# EAGLE design FXOS8700 without Extender (EAGLE 7.3.0)
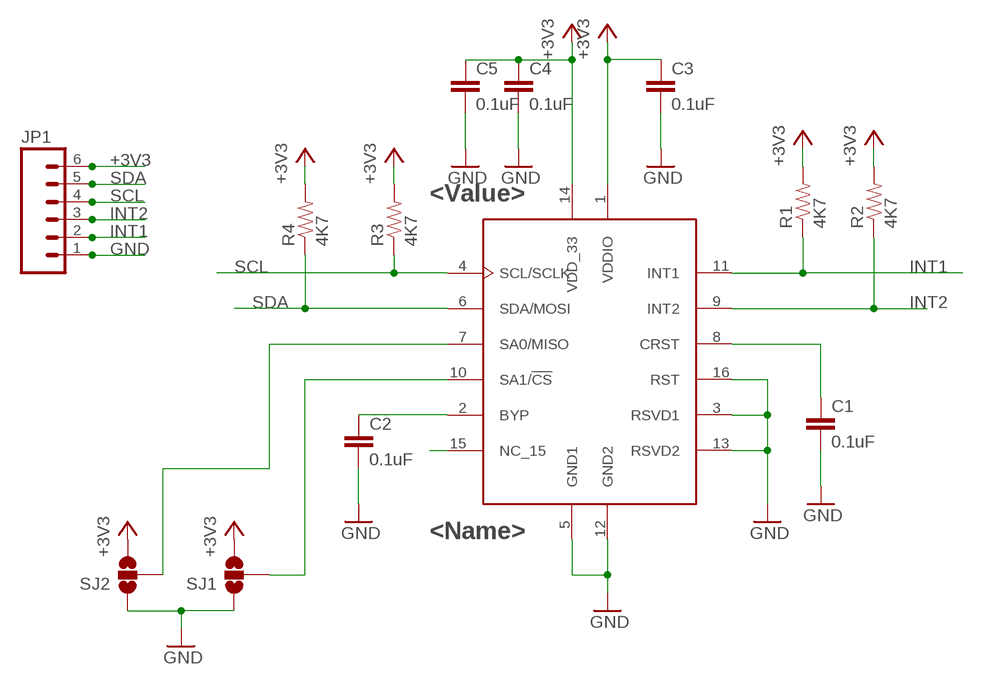
[diagram p0: schematic, sheet 1]

## Parts
C1  0.1uF  CAP0805  [0805]
C2  0.1uF  CAP0805  [0805]
C3  0.1uF  CAP0805  [0805]
C4  0.1uF  CAP0805  [0805]
C5  0.1uF  CAP0805  [0805]
JP1  M06LOCK  [1X06_LOCK]
R1  4K7  RESISTOR0805-RES  [0805]
R2  4K7  RESISTOR0805-RES  [0805]
R3  4K7  RESISTOR0805-RES  [0805]
R4  4K7  RESISTOR0805-RES  [0805]
SJ1  SOLDERJUMPER_2WAYPASTE1&2  [SJ_3_PASTE1&2]
SJ2  SOLDERJUMPER_2WAYPASTE1&2  [SJ_3_PASTE1&2]
U$1  FXOS870CQ  [QFN16_0P5_3X3]

## Nets
+3V3: C3.1 C4.1 C5.1 JP1.6 R1.2 R2.2 R3.2 R4.2 SJ1.3 SJ2.3 U$1.1(VDDIO) U$1.14(VDD_33)
GND: C1.2 C2.2 C3.2 C4.2 C5.2 JP1.1 SJ1.1 SJ2.1 U$1.3(RSVD1) U$1.5(GND1) U$1.12(GND2) U$1.13(RSVD2) U$1.16(RST)
INT1: JP1.2 R1.1 U$1.11(INT1)
INT2: JP1.3 R2.1 U$1.9(INT2)
N$5: C2.1 U$1.2(BYP)
N$6: U$1.15(NC_15)
RST: C1.1 U$1.8(CRST)
SA0: SJ2.2 U$1.7(SA0/MISO)
SA1: SJ1.2 U$1.10(SA1/!CS)
SCL: JP1.4 R3.1 U$1.4(SCL/SCLK)
SDA: JP1.5 R4.1 U$1.6(SDA/MOSI)

## Library data of the parts
C1-C5 = SparkFun-Capacitors:CAP: Capacitor Standard 0603 ceramic capacitor, and 0.1" leaded capacitor.
JP1 = SparkFun-Connectors:M06: Header 6 Standard 6-pin 0.1" header. Use with straight break away headers (SKU : PRT-00116), right angle break away headers (PRT-00553), swiss pins (PRT-00743), machine pins (PRT-00117), and female headers (PRT-00115). Molex polarized connector foot print use with SKU : PRT-08094 with associated crimp pins and housings. NOTES ON THE VARIANTS LOCK and LOCK_LONGPADS... This footprint was designed to help hold the alignment of a through-hole component (i.e. 6-pin header) while soldering it into place. You may notice that each hole has been shifted either up or down by 0.005 of an inch from it's more standard position (which is a perfectly straight line). This slight alteration caused the pins (the squares in the middle) to touch the edges of the holes. Because they are alternating, it causes a "brace" to hold the component in place. 0.005 has proven to be the perfect amount of "off-center" position when using our standard breakaway headers. Although looks a little odd when you look at the bare footprint, once you have a header in there, the alteration is very hard to notice. Also,if you push a header all the way into place, it is covered up entirely on the bottom side. This idea of altering the position of holes to aid alignment will be further integrated into the Sparkfun Library for other footprints. It can help hold any component with 3 or more connection pins.
R1-R4 = SparkFun-Passives:RESISTOR: Resistor Basic schematic elements and footprints for 0603, 1206, and PTH resistors.
SJ1 SJ2 = SparkFun-Passives:SOLDERJUMPER_2WAY: Solder Jumper 2 way solder jumper
U$1 = Freescale_Sensors:FXOS870CQ

## Board
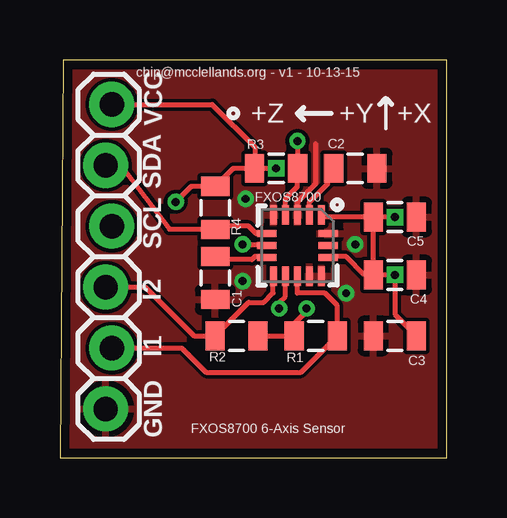
[diagram p1: board, top side]
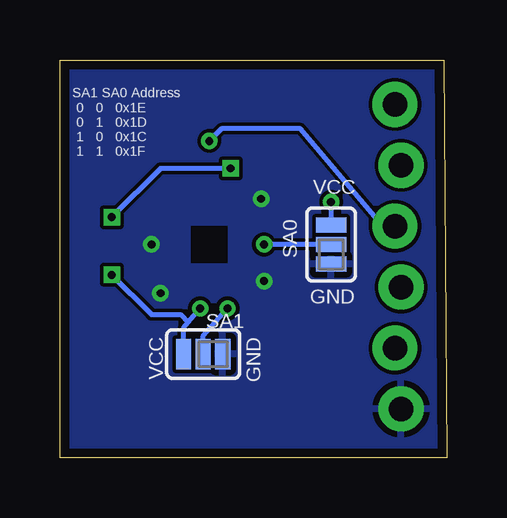
[diagram p2: board, bottom side, seen from below]

Size 16.13 x 16.59 mm. Coordinates in mm from the lower left corner, seen from the top.
Outline: 0,0 16.13,0 16.13,16.59 0.13,16.59 0,0
Copper layers (1*16): Top 0.0356mm / dielectric 1.5011mm / Bottom 0.0356mm
Design rules "OSH_DRC": minimum track width 6mil, minimum drill 13mil, track to track 6mil, track to pad 6mil, pad to pad 6mil, via to via 6mil, smd to smd 6mil, copper to edge 15mil, drill to drill 6mil, minimum pad ring 7mil, minimum via ring 7mil, stop-mask expansion 3mil, vias tented up to drill 15mil, thermal gap 10mil

### Footprints (pad centres in the part's own frame; a part is rotated, then mirrored left to right if it is on the bottom)
0805 = smd 0.8 x 1.2: 1 -0.9,0; 2 0.9,0
1X06_LOCK = drill 1.016 pad 1.88: 1 0,0; 2 2.54,-0.254; 3 5.08,0; 4 7.62,-0.254; 5 10.16,0; 6 12.7,-0.254
SJ_3_PASTE1&2 = smd 0.635 x 1.27: 1 -0.813,0; 2 0,0; 3 0.813,0
QFN16_0P5_3X3 = smd 0.813 x 0.305: 1 -1.275,1; 2 -1.275,0.5; 3 -1.275,0; 4 -1.275,-0.5; 5 -1.275,-1; 9 1.275,-1; 10 1.275,-0.5; 11 1.275,0; 12 1.275,0.5; 13 1.275,1 | smd 0.305 x 0.813: 6 -0.5,-1.275; 7 0,-1.275; 8 0.5,-1.275; 14 0.5,1.275; 15 0,1.275; 16 -0.5,1.275

### Placement (x,y rotation side)
C1  6.48,7.49 270 top
C2  12.32,12.06 0 top
C3  13.97,5.08 180 top
C4  13.97,7.62 0 top
C5  13.97,10.03 0 top
JP1  1.91,2.03 90 top
R1  10.67,5.08 180 top
R2  7.37,5.08 0 top
R3  9.02,12.06 180 top
R4  6.48,10.41 90 top
SJ1  10.16,4.32 180 bottom
SJ2  4.83,8.89 90 bottom
U$1  9.91,8.85 270 top

### Tracks (layer width: path | path; a pad name or v marks a point on that pad's centre or on a via)
+3V3  (via drill 0.33)
  Top 0.203: C5.1 11,10.03 U$1.1 | U$1.14 11.22,8.38 11.94,8.38 12.7,7.62 C4.1 | 8.13,12.08 8.13,12.95 6.35,14.73 JP1.6 | 8.13,12.08 R3.2 7.23,12.06 R4.2 5.47,11.31 v4.83,10.67 | R2.2 R1.2 | R1.2 9.77,5.22 | C4.1 v13.97,7.62 13.97,5.98 C3.1 | C4.1 C5.1 | 8.13,12.08 9.01,12.08 v9.02,12.06 | v13.97,10.03 C5.1 | v10.29,6.22 10.29,6.1 9.78,5.59 R1.2
  Bottom 0.203: v13.97,7.62 12.32,5.97 11.1,5.97 10.78,5.65 | v9.02,12.06 11.94,12.06 v13.97,10.03 | v4.83,10.67 SJ2.3 | SJ1.3 10.97,5.41 10.78,5.65 | 10.78,5.65 v10.29,6.22
GND  (via drill 0.33)
  Top 0.203: 10.67,13.08 10.67,11.43 9.91,10.67 U$1.3
  other vias: 11.94,6.86 7.75,10.79 12.32,8.89 7.62,7.37
  pour Bottom: 0,0 17.02,-0.13 17.15,16.84 -0.13,16.71
  pour Top: -0.25,-0.38 17.15,-0.38 17.28,16.46 -0.38,16.46
INT1
  Top 0.203: U$1.11 9.91,6.86 11.05,6.86 11.57,6.34 R1.1 10.04,3.56 6.1,3.56 5.08,4.57 JP1.2
INT2
  Top 0.203: U$1.9 8.89,7.55 8.89,6.86 8.51,6.48 7.87,6.48 R2.1 5.59,5.08 3.56,7.11 JP1.3
N$1
  cutout Top: 9.14,9.65 10.67,9.65 10.67,8.13 9.14,8.13
  cutout Bottom: 9.14,9.65 10.67,9.65 10.67,8.13 9.14,8.13
N$5
  Top 0.203: C2.1 11.42,11.93 | U$1.2 10.41,10.66 11.18,11.43 11.18,11.82 C2.1 | C2.1
RST
  Top 0.203: U$1.8 8.59,8.39 8.14,8.39 8,8.26 6.62,8.26 C1.1
SA0  (via drill 0.33)
  Top 0.203: v7.62,8.89 8.59,8.89 U$1.7
  Bottom 0.203: SJ2.2 v7.62,8.89
SA1  (via drill 0.33)
  Top 0.203: v9.14,6.22 9.14,6.48 9.4,6.73 9.4,7.56 U$1.10
  Bottom 0.203: SJ1.2 10.16,5.08 v9.14,6.22
SCL  (via drill 0.33)
  Top 0.203: U$1.4 9.41,10.81 9.91,11.3 9.91,12.05 R3.1 9.91,12.08 v9.91,13.21
  Bottom 0.203: JP1.4 2.67,9.65 6.1,13.72 9.4,13.72 v9.91,13.21
SDA
  Top 0.203: U$1.6 8.56,9.35 8.18,9.35 7.87,9.65 6.62,9.65 R4.1 6.47,9.53 4.57,9.53 2.54,12.19 JP1.5

### Text on the board
tPlace: chip@mcclellands.org - v1 - 10-13-15 | VCC | +Z | +Y | +X | SDA | FXOS8700 | SCL | I2 | I1 | GND | FXOS8700 6-Axis Sensor
bPlace: SA1 SA0 Address / 0 0 0x1E / 0 1 0x1D / 1 0 0x1C / 1 1 0x1F | VCC | SA0 | GND | SA1 | GND | VCC